# EAGLE design electric-imp-shield-v11 (EAGLE 6.2)
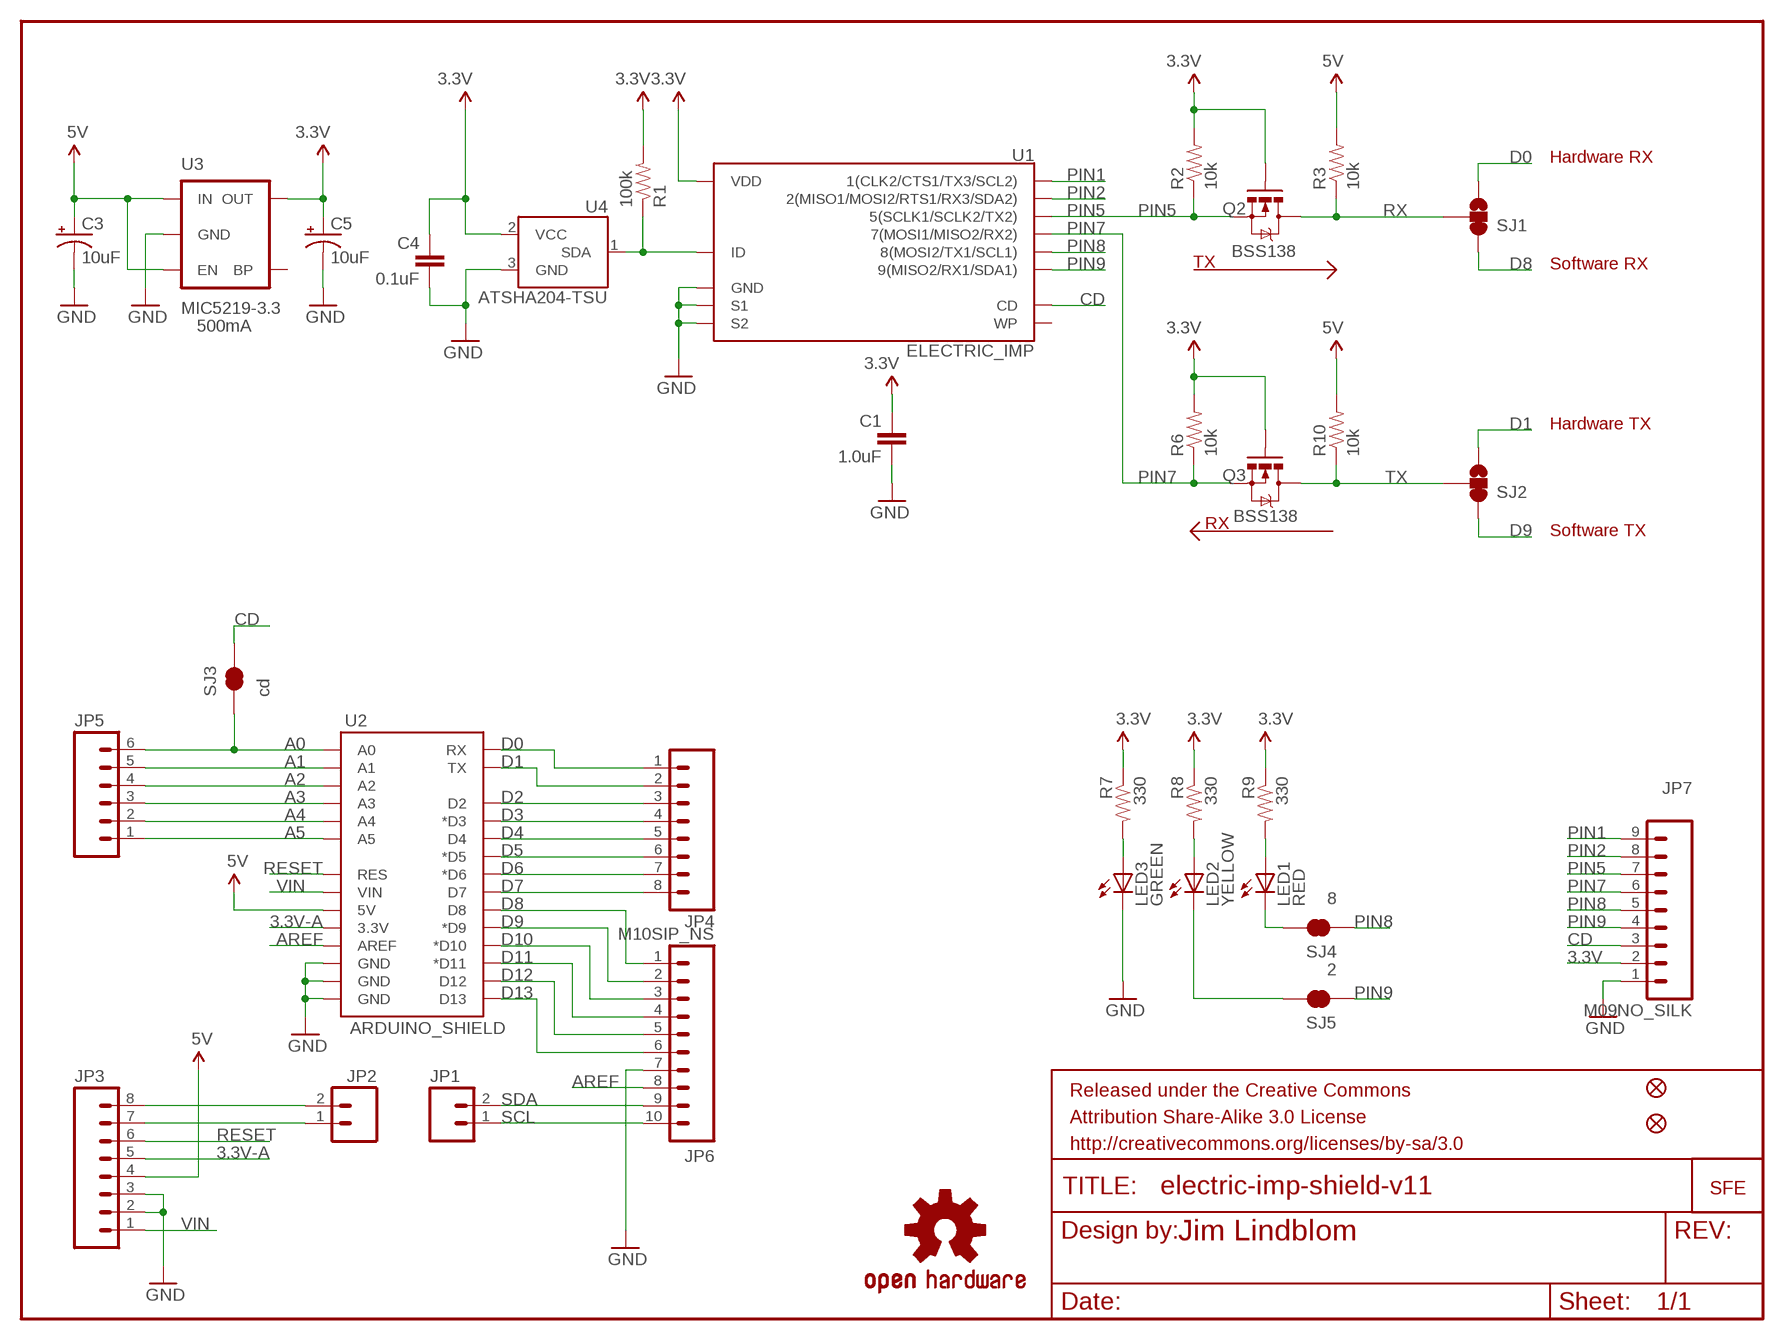
[diagram p0: schematic, sheet 1]

## Parts
C1  1.0uF  CAP0402-CAP  [0402-CAP]
C3  10uF  CAP_POL1206  [EIA3216]
C4  0.1uF  CAP0402-CAP  [0402-CAP]
C5  10uF  CAP_POL1206  [EIA3216]
JP1  M021X02_NO_SILK  [1X02_NO_SILK]
JP2  M021X02_NO_SILK  [1X02_NO_SILK]
JP3  M08SIP_NS  [1X08_NO_SILK]
JP4  M08SIP_NS  [1X08_NO_SILK]
JP5  M06SIP_NS  [1X06_NO_SILK]
JP6  M10SIP_NS  [1X10_NO_SILK]
JP7  M09NO_SILK  [1X09_NO_SILK]
JP8  FIDUCIALUFIDUCIAL  [MICRO-FIDUCIAL]
JP9  FIDUCIALUFIDUCIAL  [MICRO-FIDUCIAL]
JP10  LOGO-SFENW2  [SFE-NEW-WEB]
LED1  RED  LED0603  [LED-0603]
LED2  YELLOW  LED0603  [LED-0603]
LED3  GREEN  LED0603  [LED-0603]
Q2  BSS138  MOSFET-NCHANNELSMD  [SOT23-3]
Q3  BSS138  MOSFET-NCHANNELSMD  [SOT23-3]
R1  100k  RESISTOR0402-RES  [0402-RES]
R2  10k  RESISTOR0402-RES  [0402-RES]
R3  10k  RESISTOR0402-RES  [0402-RES]
R6  10k  RESISTOR0402-RES  [0402-RES]
R7  330  RESISTOR0402-RES  [0402-RES]
R8  330  RESISTOR0402-RES  [0402-RES]
R9  330  RESISTOR0402-RES  [0402-RES]
R10  10k  RESISTOR0402-RES  [0402-RES]
SJ1  SOLDERJUMPER_2WAYS  [SJ_3]
SJ2  SOLDERJUMPER_2WAYS  [SJ_3]
SJ3  cd  SOLDERJUMPERTRACE  [SJ_2S-TRACE]
SJ4  8  SOLDERJUMPERTRACE  [SJ_2S-TRACE]
SJ5  2  SOLDERJUMPERTRACE  [SJ_2S-TRACE]
U1  ELECTRIC_IMP  [SD_MMC_SOCKET]
U2  ARDUINO_SHIELD  ARDUINO_SHIELDNOHOLESORLABELS  [DUEMILANOVE_SHIELD_NOHOLES_NOLABELS]
U3  MIC5219-3.3  V_REG_LDOSMD  [SOT23-5]
U4  ATSHA204-TSU  [SOT23-3]
U$7  OSHW-LOGOS  [OSHW-LOGO-S]

## Nets
3.3V: C1.1 C4.1 C5.A(+) JP7.2 Q2.1(G) Q3.1(G) R1.2 R2.2 R6.2 R7.1 R8.1 R9.1 U1.4(VDD) U3.5(OUT) U4.2(VCC)
3.3V-A: JP3.5 U2.3.3V
5V: C3.A(+) JP3.4 R3.2 R10.2 U2.5V U3.1(IN) U3.3(EN)
A0: JP5.6 SJ3.1 U2.A0
A1: JP5.5 U2.A1
A2: JP5.4 U2.A2
A3: JP5.3 U2.A3
A4: JP5.2 U2.A4
A5: JP5.1 U2.A5
ACTIVITY: LED1.C SJ4.2
AREF: JP6.8 U2.AREF
CD: JP7.3 SJ3.2 U1.CD
D0: JP4.1 SJ1.3 U2.RX
D1: JP4.2 SJ2.3 U2.TX
D2: JP4.3 U2.D2
D3: JP4.4 U2.D3(*D3)
D4: JP4.5 U2.D4
D5: JP4.6 U2.D5(*D5)
D6: JP4.7 U2.D6(*D6)
D7: JP4.8 U2.D7
D8: JP6.1 SJ1.1 U2.D8
D9: JP6.2 SJ2.1 U2.D9(*D9)
D10: JP6.3 U2.D10(*D10)
D11: JP6.4 U2.D11(*D11)
D12: JP6.5 U2.D12
D13: JP6.6 U2.D13
GND: C1.2 C3.C(-) C4.2 C5.C(-) JP3.2 JP3.3 JP6.7 JP7.1 LED3.C U1.3(GND) U1.S1 U1.S2 U2.GND@0(GND) U2.GND@1(GND) U2.GND@2(GND) U3.2(GND) U4.3(GND)
LINK: LED2.C SJ5.2
N$2: R1.1 U1.6(ID) U4.1(SDA)
N$10: JP2.2 JP3.8
N$11: JP2.1 JP3.7
N$12: LED3.A R7.2
N$13: LED2.A R8.2
N$14: LED1.A R9.2
PIN1: JP7.9 U1.1(1(CLK2/CTS1/TX3/SCL2))
PIN2: JP7.8 U1.2(2(MISO1/MOSI2/RTS1/RX3/SDA2))
PIN5: JP7.7 Q2.2(S) R2.1 U1.5(5(SCLK1/SCLK2/TX2))
PIN7: JP7.6 Q3.2(S) R6.1 U1.7(7(MOSI1/MISO2/RX2))
PIN8: JP7.5 SJ4.1 U1.8(8(MOSI2/TX1/SCL1))
PIN9: JP7.4 SJ5.1 U1.9(9(MISO2/RX1/SDA1))
RESET: JP3.6 U2.RES
RX: Q2.3(D) R3.1 SJ1.2
SCL: JP1.1 JP6.10
SDA: JP1.2 JP6.9
TX: Q3.3(D) R10.1 SJ2.2
VIN: JP3.1 U2.VIN
Unconnected: U1.WP U3.4(BP)

## Notes on the sheet
- Hardware RX
- TX | Software RX
- 500mA
- Hardware TX
- RX
- Software TX
- Jim Lindblom

## Library data of the parts
C1 C4 = SparkFun-Passives:CAP: Capacitor Standard 0603 ceramic capacitor, and 0.1" leaded capacitor.
C3 C5 = SparkFun-Passives:CAP_POL: Capacitor Polarized These are standard SMD and PTH capacitors. Normally 10uF, 47uF, and 100uF in electrolytic and tantalum varieties. Always verify the external diameter of the through hole cap, it varies with capacity, voltage, and manufacturer. The EIA devices should be standard.
JP1 JP2 = SparkFun-Connectors:M02: Header 2 Standard 2-pin 0.1" header. Use with straight break away headers (SKU : PRT-00116), right angle break away headers (PRT-00553), swiss pins (PRT-00743), machine pins (PRT-00117), and female headers (PRT-00115). Molex polarized connector foot print use with SKU : PRT-08233 with associated crimp pins and housings.
JP3 JP4 = SparkFun-Connectors:M08: Header 8 Standard 8-pin 0.1" header. Use with straight break away headers (SKU : PRT-00116), right angle break away headers (PRT-00553), swiss pins (PRT-00743), machine pins (PRT-00117), and female headers (PRT-00115).
JP5 = SparkFun-Connectors:M06: Header 6 Standard 6-pin 0.1" header. Use with straight break away headers (SKU : PRT-00116), right angle break away headers (PRT-00553), swiss pins (PRT-00743), machine pins (PRT-00117), and female headers (PRT-00115). Molex polarized connector foot print use with SKU : PRT-08094 with associated crimp pins and housings. NOTES ON THE VARIANTS LOCK and LOCK_LONGPADS... This footprint was designed to help hold the alignment of a through-hole component (i.e. 6-pin header) while soldering it into place. You may notice that each hole has been shifted either up or down by 0.005 of an inch from it's more standard position (which is a perfectly straight line). This slight alteration caused the pins (the squares in the middle) to touch the edges of the holes. Because they are alternating, it causes a "brace" to hold the component in place. 0.005 has proven to be the perfect amount of "off-center" position when using our standard breakaway headers. Although looks a little odd when you look at the bare footprint, once you have a header in there, the alteration is very hard to notice. Also, if you push a header all the way into place, it is covered up entirely on the bottom side. This idea of altering the position of holes to aid alignment will be further integrated into the Sparkfun Library for other footprints. It can help hold any component with 3 or more connection pins.
JP6 = SparkFun-Connectors:M10: Header 10 Standard 10-pin 0.1" header. Use with straight break away headers (SKU : PRT-00116), right angle break away headers (PRT-00553), swiss pins (PRT-00743), machine pins (PRT-00117), and female headers (PRT-00115).
JP7 = SparkFun-Connectors:M09: Header 9 Standard 9-pin 0.1" header. Use with straight break away headers (SKU : PRT-00116), right angle break away headers (PRT-00553), swiss pins (PRT-00743), machine pins (PRT-00117), and female headers (PRT-00115).
JP8 JP9 = SparkFun:FIDUCIAL: Fiducial Alignment Points Various fiducial points for machine vision alignment.
JP10 = SparkFun-Aesthetics:LOGO-SFE: Spark Fun Electronics PCB Logo This is the standard Spark Fun Electronics PCB logo.
LED1-LED3 = SparkFun-LED:LED: LEDs Standard schematic elements and footprints for 5mm, 3mm, 1206, and 0603 sized LEDs. 5mm - Spark Fun Electronics SKU : COM-00529 (and others)
Q2 Q3 = SparkFun-DiscreteSemi:MOSFET-NCHANNEL: Generic NMOS footprint
R1-R3 R6-R10 = SparkFun-Passives:RESISTOR: Resistor Basic schematic elements and footprints for 0603, 1206, and PTH resistors.
SJ1 SJ2 = SparkFun-Passives:SOLDERJUMPER_2WAY: Solder Jumper 2 way solder jumper
SJ3-SJ5 = SparkFun-Passives:SOLDERJUMPER: Solder Jumper Standard SMD solder jumper. Used to automate production. Two varients : Normally Open and Normally Closed are the same, but have different paste layers. NC will have a large amount of paste and should jumper during reflow.
U1 = SparkFun-RF:ELECTRIC_IMP
U2 = SparkFun-Boards:ARDUINO_SHIELD: Arduino shield footprint
U3 = SparkFun-PowerIC:V_REG_LDO: Voltage Regulator LDO Standard 150mA LDO voltage regulator in SOT-23 layout. Micrel part MIC5205. BP (by-pass) pin is used to lower output noise with 470pF cap.
U4 = SparkFun-DigitalIC:ATSHA204
U$7 = SparkFun-Aesthetics:OSHW-LOGO: Open Source Hardware Logo This logo indicates the piece of hardware it is found on incorporates a OSHW license and/or adheres to the definition of open source hardware found here: http://freedomdefined.org/OSHW

## Board
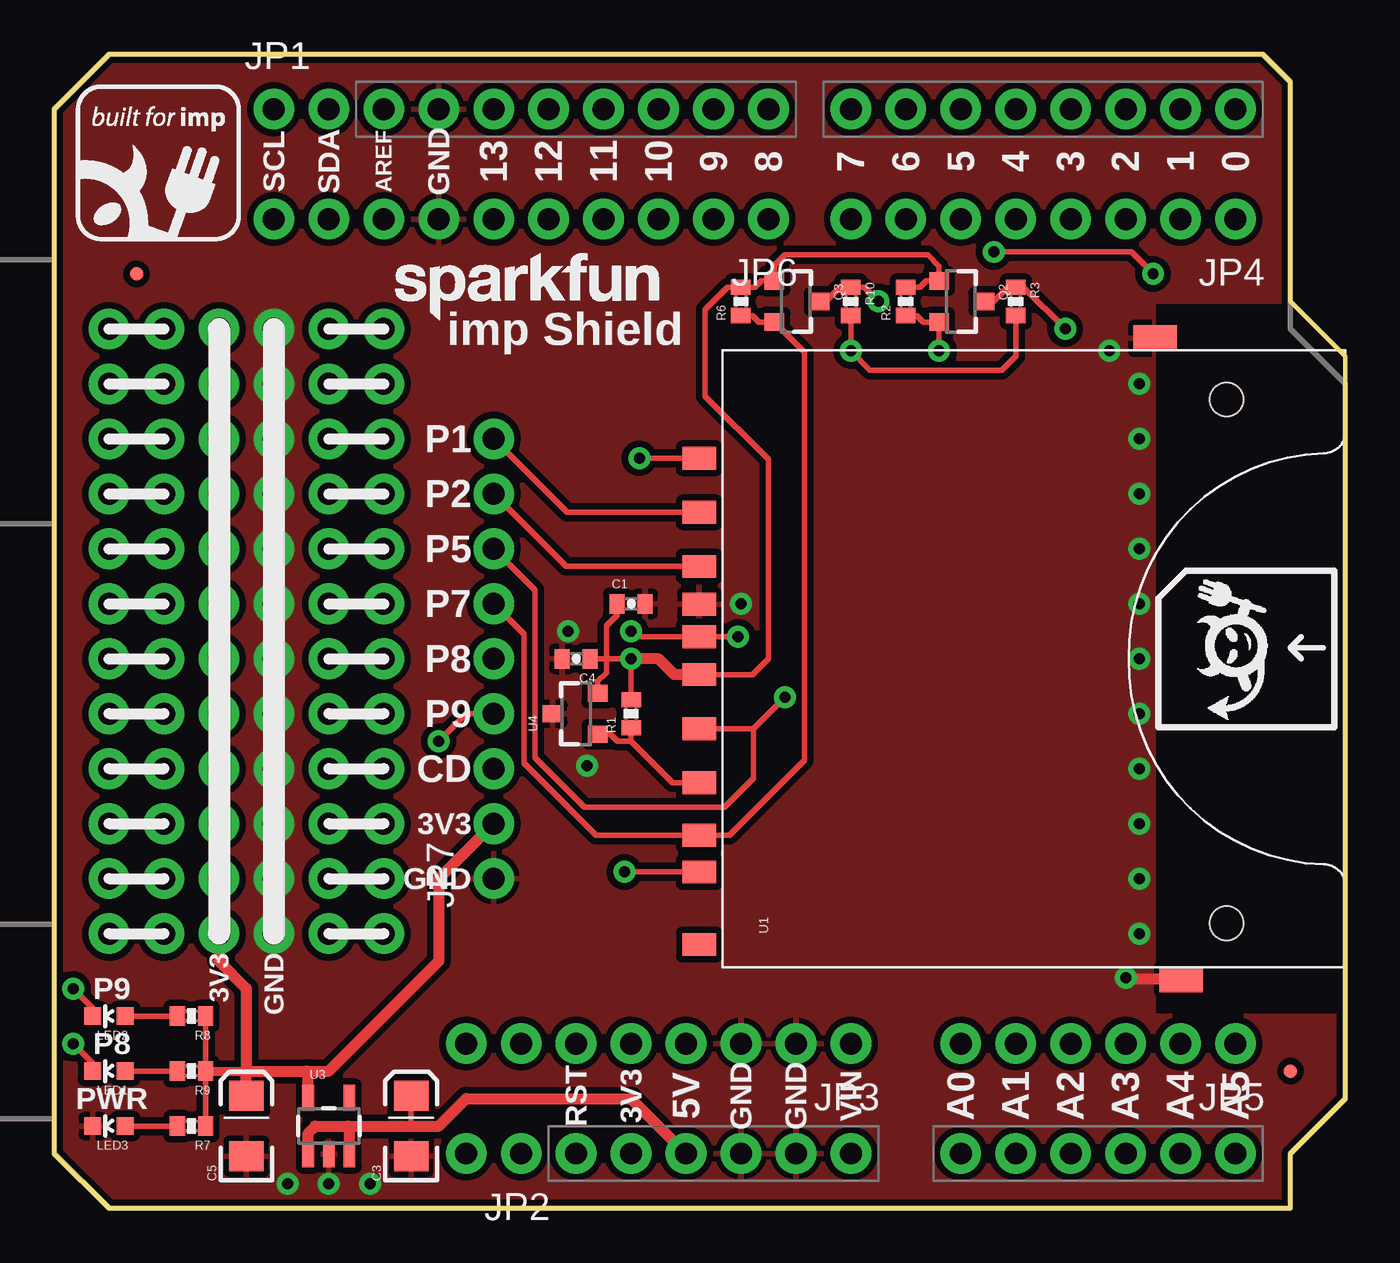
[diagram p1: board, top side]
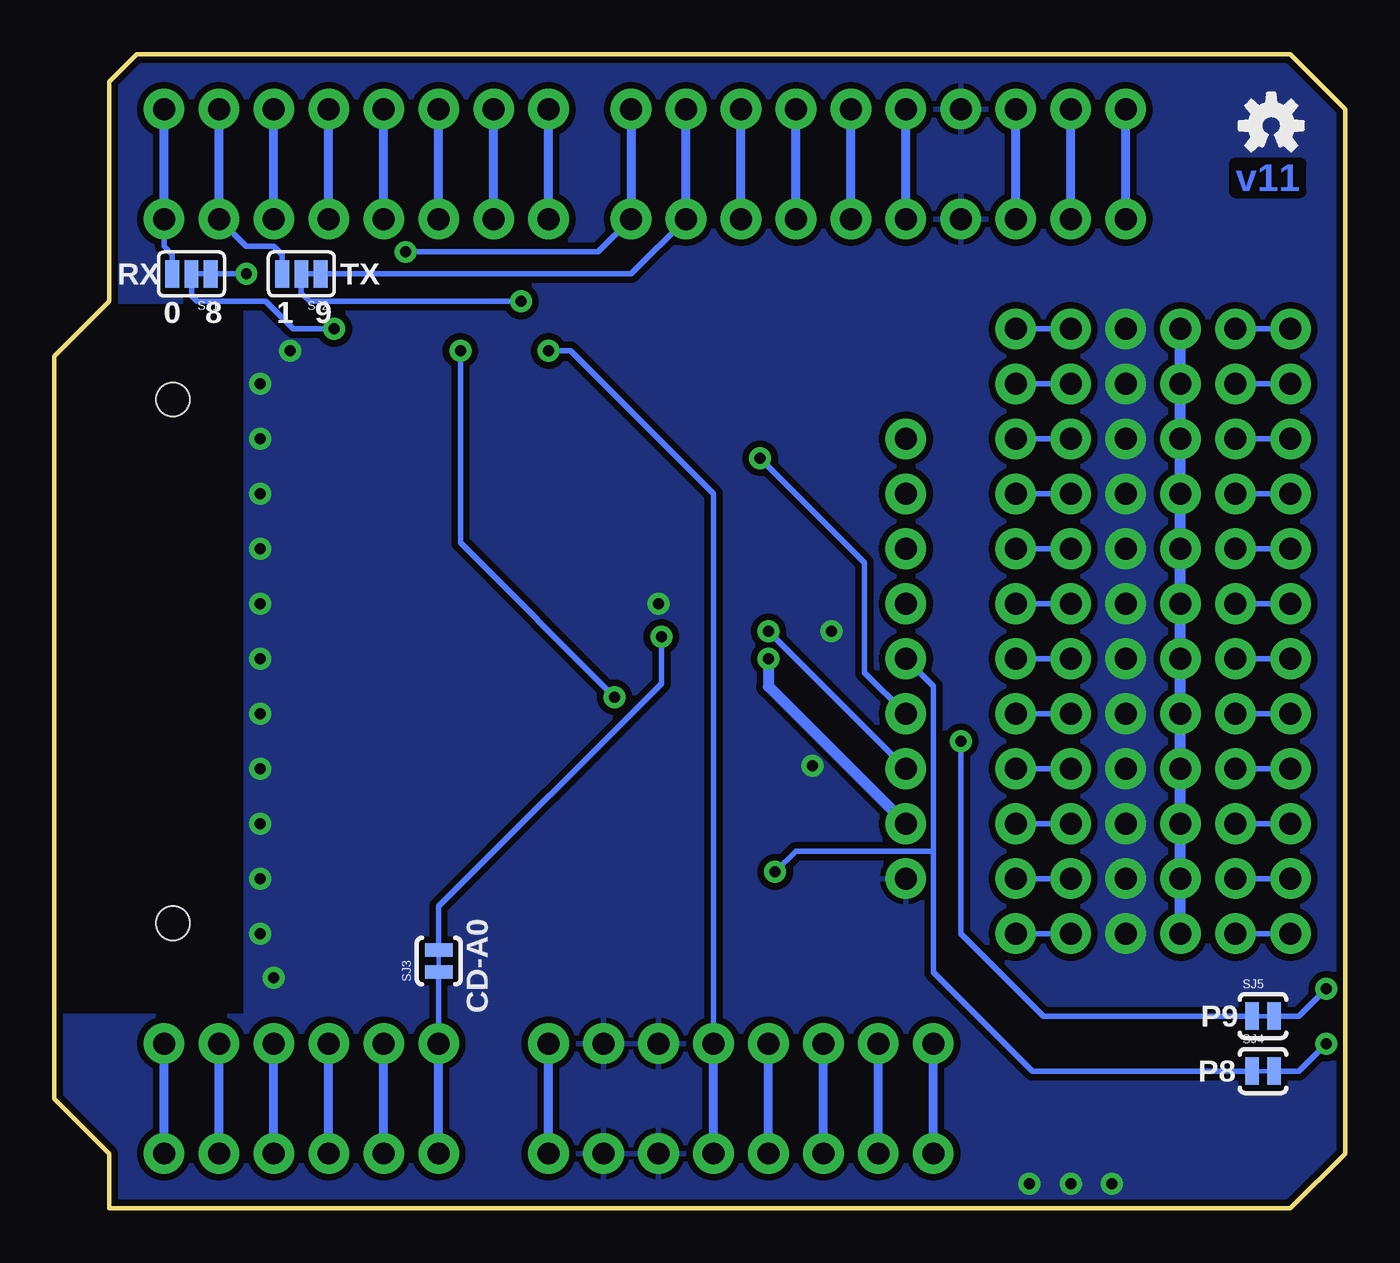
[diagram p2: board, bottom side, seen from below]

Size 59.69 x 53.34 mm. Coordinates in mm from the lower left corner, seen from the top.
Outline: 0,50.8 2.54,53.34 55.88,53.34 57.15,52.07 57.15,41.91 59.69,39.37 59.69,5.08 57.15,2.54 57.15,0 2.54,0 0,2.54 0,50.8
Copper layers (1*16): Top 0.035mm / dielectric 1.5mm / Bottom 0.035mm
Design rules: minimum track width 8mil, minimum drill 20mil, track to track 8mil, track to pad 8mil, pad to pad 8mil, via to via 8mil, smd to smd 8mil, copper to edge 8mil, drill to drill 8mil, minimum pad ring 12mil, minimum via ring 10mil, stop-mask expansion 4mil, vias tented up to drill 20mil, thermal gap 10mil

### Footprints (pad centres in the part's own frame; a part is rotated, then mirrored left to right if it is on the bottom)
0402-CAP = smd 0.7 x 0.9: 1 -0.65,0; 2 0.65,0
EIA3216 = smd 1.4 x 1.6: A 1.4,0; C -1.4,0
1X02_NO_SILK = drill 1.016 pad 1.88: 1 0,0; 2 2.54,0
1X08_NO_SILK = drill 1.016 pad 1.88: 1 0,0; 2 2.54,0; 3 5.08,0; 4 7.62,0; 5 10.16,0; 6 12.7,0; 7 15.24,0; 8 17.78,0
1X06_NO_SILK = drill 1.016 pad 1.88: 1 0,0; 2 2.54,0; 3 5.08,0; 4 7.62,0; 5 10.16,0; 6 12.7,0
1X10_NO_SILK = drill 1.016 pad 1.88: 1 0,0; 2 2.54,0; 3 5.08,0; 4 7.62,0; 5 10.16,0; 6 12.7,0; 7 15.24,0; 8 17.78,0; 9 20.32,0; 10 22.86,0
1X09_NO_SILK = drill 1.016 pad 1.88: 1 0,0; 2 2.54,0; 3 5.08,0; 4 7.62,0; 5 10.16,0; 6 12.7,0; 7 15.24,0; 8 17.78,0; 9 20.32,0
MICRO-FIDUCIAL = smd 0.635 x 0.635: 1 0,0
LED-0603 = smd 0.8 x 0.8: A 0,-0.75; C 0,0.75
SOT23-3 = smd 0.8 x 0.9: 1 -0.95,-1; 2 0.95,-1; 3 0,1.1
0402-RES = smd 0.7 x 0.9: 1 -0.65,0; 2 0.65,0
SJ_3 = smd 0.635 x 1.27: 1 -0.889,0; 2 0,0; 3 0.889,0
SJ_2S-TRACE = smd 0.635 x 1.27: 1 -0.508,0; 2 0.508,0
SD_MMC_SOCKET = smd 1.05 x 1.56: 1 6.77,29.87; 2 4.27,29.87; 3 2.52,29.87; 4 -0.73,29.87; 5 -3.23,29.87; 6 -5.73,29.87; 7 -8.15,29.87; 8 -9.85,29.87; 9 9.27,29.87; CD 1.02,29.87; WP -13.2,29.87 | smd 1.2 x 2: S1 -14.8,7.6; S2 14.8,8.8 | hole 1.55: 11.98,5.5; -12.22,5.5
DUEMILANOVE_SHIELD_NOHOLES_NOLABELS = drill 1.016 pad 1.88: 3.3V 50.8,26.67; 5V 50.8,29.21; A0 50.8,41.91; A1 50.8,44.45; A2 50.8,46.99; A3 50.8,49.53; A4 50.8,52.07; A5 50.8,54.61; AREF 2.54,15.24; D2 2.54,49.53; D3 2.54,46.99; D4 2.54,44.45; D5 2.54,41.91; D6 2.54,39.37; D7 2.54,36.83; D8 2.54,33.02; D9 2.54,30.48; D10 2.54,27.94; D11 2.54,25.4; D12 2.54,22.86; D13 2.54,20.32; GND@0 50.8,31.75; GND@1 50.8,34.29; GND@2 2.54,17.78; RES 50.8,24.13; RX 2.54,54.61; TX 2.54,52.07; VIN 50.8,36.83
SOT23-5 = smd 0.55 x 1.2: 1 -0.95,-1.3; 2 0,-1.3; 3 0.95,-1.3; 4 0.95,1.3; 5 -0.95,1.3

### Placement (x,y rotation side)
C1  26.67,27.94 0 top
C3  16.51,3.81 90 top
C4  24.13,25.4 180 top
C5  8.89,3.81 90 top
JP1  10.16,50.8 0 top
JP2  21.59,2.54 180 top
JP3  36.83,7.62 180 top
JP4  54.61,45.72 180 top
JP5  54.61,7.62 180 top
JP6  33.02,45.72 180 top
JP7  20.32,15.24 90 top
JP8  57.15,6.35 0 top
JP9  3.81,43.18 0 top
JP10  15.75,41.02 0 top
LED1  2.54,6.35 90 top
LED2  2.54,8.89 90 top
LED3  2.54,3.81 90 top
Q2  41.91,41.91 270 top
Q3  34.29,41.91 270 top
R1  26.67,22.86 90 top
R2  39.37,41.91 90 top
R3  44.45,41.91 270 top
R6  31.75,41.91 90 top
R7  6.35,3.81 180 top
R8  6.35,8.89 180 top
R9  6.35,6.35 180 top
R10  36.83,41.91 270 top
SJ1  53.34,43.18 180 bottom
SJ2  48.26,43.18 180 bottom
SJ3  41.91,11.43 90 bottom
SJ4  3.81,6.35 0 bottom
SJ5  3.81,8.89 0 bottom
U1  59.69,25.4 90 top
U2  0,53.34 270 top
U3  12.7,3.81 0 top
U4  24.13,22.86 90 top
U$7  3.43,50.04 0 bottom

### Tracks (layer width: path | path; a pad name or v marks a point on that pad's centre or on a via)
3.3V  (via drill 0.51, 1.02 pad 1.88)
  Top 0.254: R8.1 R9.1 R7.1 | C4.1 25.53,25.4 | 25.53,25.4 v26.67,25.4 R1.2 | U4.2 25.13,24.37 25.53,24.77 25.53,25.4 | U1.4 32.29,24.67 33.02,25.4 33.02,34.61 30.1,37.53 30.1,41.53 31.13,42.56 R6.2 32.4,42.56 32.7,42.86 Q3.1 33.29,43.58 33.78,44.07 40.39,44.07 40.91,43.55 Q2.1 40.32,42.86 40.02,42.56 R2.2 | 25.53,25.4 25.53,26.92 26.02,27.42 C1.1
  Top 0.406: R9.1 8.89,6.35 | 11.75,6.28 11.68,6.35
  Top 0.508: v26.67,25.4 27.94,25.4 28.67,24.67 U1.4 | 8.89,6.35 11.68,6.35 12.7,6.35 17.78,11.43 17.78,15.24 JP7.2 | U3.5 11.75,6.28 | C5.A 8.89,6.35 | v7.62,12.7 7.62,11.43 8.89,10.16 8.89,6.35
  Bottom 0.508: v7.62,12.7 v7.62,15.24 v7.62,17.78 v7.62,20.32 v7.62,22.86 v7.62,25.4 v7.62,27.94 v7.62,30.48 v7.62,33.02 v7.62,35.56 v7.62,38.1 v7.62,40.64 | v26.67,25.4 26.67,24.13 JP7.2
3.3V-A
  Bottom 0.406: U2.3.3V JP3.5
5V  (via drill 0.51)
  Top 0.254: R10.2 v36.83,39.62 37.72,38.73 43.81,38.73 44.45,39.37 R3.2 | C3.A 16.51,3.81
  Top 0.406: 13.65,3.75 13.59,3.81
  Top 0.508: U2.5V 26.67,5.08 19.05,5.08 17.78,3.81 16.51,3.81 13.59,3.81 12.06,3.81 11.75,3.5 U3.1 | U3.3 13.65,3.75
  Bottom 0.254: JP3.4 29.21,33.02 35.81,39.62 v36.83,39.62
  Bottom 0.406: U2.5V JP3.4
A0
  Bottom 0.254: JP5.6 SJ3.1
  Bottom 0.406: U2.A0 JP5.6
A1
  Bottom 0.406: U2.A1 JP5.5
A2
  Bottom 0.406: U2.A2 JP5.4
A3
  Bottom 0.406: U2.A3 JP5.3
A4
  Bottom 0.406: U2.A4 JP5.2
A5
  Bottom 0.406: U2.A5 JP5.1
ACTIVITY  (via drill 0.51)
  Top 0.254: LED1.C 1.79,6.72 v0.89,7.62
  Bottom 0.254: SJ4.2 2.16,6.35 v0.89,7.62
AREF
  Bottom 0.406: JP6.8 U2.AREF
CD  (via drill 0.51)
  Top 0.254: v31.62,26.42 U1.CD 26.92,26.42 v26.67,26.67
  Bottom 0.254: SJ3.2 41.91,13.97 31.62,24.26 v31.62,26.42 | JP7.3 v26.67,26.67
D0
  Bottom 0.254: SJ1.3 54.23,44.07 54.61,44.45 JP4.1
  Bottom 0.406: JP4.1 U2.RX
D1
  Bottom 0.254: SJ2.3 49.15,44.07 49.53,44.45 50.8,44.45 JP4.2
  Bottom 0.406: JP4.2 U2.TX
D2
  Bottom 0.406: JP4.3 U2.D2
D3
  Bottom 0.406: JP4.4 U2.D3
D4
  Bottom 0.406: JP4.5 U2.D4
D5
  Bottom 0.406: JP4.6 U2.D5
D6
  Bottom 0.406: JP4.7 U2.D6
D7
  Bottom 0.406: JP4.8 U2.D7
D8  (via drill 0.51)
  Top 0.254: v43.43,44.2 49.78,44.2 v50.8,43.18
  Bottom 0.254: v43.43,44.2 34.54,44.2 JP6.1 | SJ1.1 v50.8,43.18
  Bottom 0.406: U2.D8 JP6.1
D9
  Bottom 0.254: SJ2.1 33.02,43.18 JP6.2
  Bottom 0.406: JP6.2 U2.D9
D10
  Bottom 0.406: JP6.3 U2.D10
D11
  Bottom 0.406: JP6.4 U2.D11
D12
  Bottom 0.406: JP6.5 U2.D12
D13
  Bottom 0.406: JP6.6 U2.D13
GND  (via drill 0.51, 1.02 pad 1.88)
  Top 0.508: U1.S1 49.6,10.6 v49.53,10.67
  other vias: 31.75,27.94 48.77,39.62 10.16,40.64 10.16,38.1 10.16,35.56 10.16,33.02 10.16,30.48 10.16,27.94 10.16,25.4 10.16,22.86 10.16,20.32 10.16,17.78 10.16,15.24 10.16,12.7 23.75,26.67 24.64,20.45 50.16,12.7 50.16,15.24 50.16,17.78 50.16,20.32 50.16,22.86 50.16,25.4 50.16,27.94 50.16,30.48 50.16,33.02 50.16,35.56 50.16,38.1 10.79,1.14 14.61,1.14 12.7,1.14
  pour Top (isolate 0.305): 0,53.34 0,0 59.69,0 59.69,8.89 50.8,8.89 50.8,41.91 59.69,41.91 59.69,53.34
  pour Bottom (isolate 0.305): 0,53.34 0,0 59.69,0 59.69,8.89 50.8,8.89 50.8,41.91 59.69,41.91 59.69,53.34
LINK  (via drill 0.51)
  Top 0.254: LED2.C 1.79,9.26 v0.89,10.16
  Bottom 0.254: SJ5.2 2.16,8.89 v0.89,10.16
N$2
  Top 0.254: U1.6 28.59,19.67 26.67,21.59 | 26.67,21.59 R1.1 | U4.1 25.71,21.91 26.04,21.59 26.67,21.59
N$10
  Bottom 0.406: JP2.2 JP3.8
N$11
  Bottom 0.406: JP2.1 JP3.7
N$12
  Top 0.254: R7.2 LED3.A
N$13
  Top 0.254: R8.2 LED2.A
N$14
  Top 0.254: R9.2 LED1.A
N$15  (via drill 1.02 pad 1.88)
  Bottom 0.254: v12.7,15.24 v15.24,15.24
N$17  (via drill 1.02 pad 1.88)
  Bottom 0.254: v12.7,12.7 v15.24,12.7
N$22  (via drill 1.02 pad 1.88)
  Bottom 0.254: v5.08,12.7 v2.54,12.7
N$24  (via drill 1.02 pad 1.88)
  Bottom 0.254: v12.7,17.78 v15.24,17.78
N$29  (via drill 1.02 pad 1.88)
  Bottom 0.254: v5.08,17.78 v2.54,17.78
N$31  (via drill 1.02 pad 1.88)
  Bottom 0.254: v5.08,40.64 v2.54,40.64
N$36  (via drill 1.02 pad 1.88)
  Bottom 0.254: v12.7,40.64 v15.24,40.64
N$40  (via drill 1.02 pad 1.88)
  Bottom 0.254: v12.7,20.32 v15.24,20.32
N$45  (via drill 1.02 pad 1.88)
  Bottom 0.254: v5.08,20.32 v2.54,20.32
N$48  (via drill 1.02 pad 1.88)
  Bottom 0.254: v12.7,22.86 v15.24,22.86
N$49  (via drill 1.02 pad 1.88)
  Bottom 0.254: v5.08,15.24 v2.54,15.24
N$55  (via drill 1.02 pad 1.88)
  Bottom 0.254: v5.08,22.86 v2.54,22.86
N$56  (via drill 1.02 pad 1.88)
  Bottom 0.254: v12.7,25.4 v15.24,25.4
N$61  (via drill 1.02 pad 1.88)
  Bottom 0.254: v5.08,25.4 v2.54,25.4
N$64  (via drill 1.02 pad 1.88)
  Bottom 0.254: v15.24,27.94 v12.7,27.94
N$69  (via drill 1.02 pad 1.88)
  Bottom 0.254: v5.08,27.94 v2.54,27.94
N$70  (via drill 1.02 pad 1.88)
  Bottom 0.254: v12.7,30.48 v15.24,30.48
N$75  (via drill 1.02 pad 1.88)
  Bottom 0.254: v5.08,30.48 v2.54,30.48
N$78  (via drill 1.02 pad 1.88)
  Bottom 0.254: v12.7,33.02 v15.24,33.02
N$83  (via drill 1.02 pad 1.88)
  Bottom 0.254: v5.08,33.02 v2.54,33.02
N$84  (via drill 1.02 pad 1.88)
  Bottom 0.254: v12.7,35.56 v15.24,35.56
N$89  (via drill 1.02 pad 1.88)
  Bottom 0.254: v5.08,35.56 v2.54,35.56
N$92  (via drill 1.02 pad 1.88)
  Bottom 0.254: v5.08,38.1 v2.54,38.1
N$97  (via drill 1.02 pad 1.88)
  Bottom 0.254: v12.7,38.1 v15.24,38.1
N$99
  Bottom 0.254: 48.26,43.18 47.37,43.18
N$100
  Bottom 0.254: 53.34,43.18 52.45,43.18
PIN1
  Top 0.254: U1.1 23.71,32.17 JP7.9
PIN2
  Top 0.254: U1.2 23.67,29.67 JP7.8
PIN5  (via drill 0.51)
  Top 0.254: U1.5 32.33,22.17 | R2.1 39.89,41.26 40.19,40.96 Q2.2 v40.91,39.64 | 32.33,22.17 32.33,19.88 30.99,18.54 24.51,18.54 22.23,20.83 22.23,28.57 JP7.7 | v33.78,23.62 32.33,22.17
  Bottom 0.254: v33.78,23.62 40.91,30.75 v40.91,39.64
PIN7
  Top 0.254: R6.1 32.27,41.26 32.57,40.96 Q3.2 34.69,39.56 34.69,20.72 31.22,17.25 U1.7 25.04,17.25 21.72,20.57 21.72,26.54 JP7.6
PIN8  (via drill 0.51)
  Top 0.254: v26.36,15.55 U1.8
  Bottom 0.254: SJ4.1 14.48,6.35 19.05,10.92 19.05,16.51 | 19.05,16.51 19.05,24.13 JP7.5 | v26.36,15.55 25.4,16.51 19.05,16.51
PIN9  (via drill 0.51)
  Top 0.254: U1.9 v27.05,34.67 | JP7.4 19.05,22.86 v17.78,21.59
  Bottom 0.254: JP7.4 22.23,24.77 22.23,29.84 v27.05,34.67 | v17.78,21.59 17.78,12.7 13.97,8.89 SJ5.1
RESET
  Bottom 0.406: U2.RES JP3.6
RX  (via drill 0.51)
  Top 0.254: Q2.3 43.43,41.91 44.08,42.56 R3.1 44.82,42.56 v46.74,40.64
  Bottom 0.254: SJ1.2 53.34,42.16 53.09,41.91 49.91,41.91 48.64,40.64 v46.74,40.64
SCL
  Bottom 0.406: JP6.10 JP1.1
SDA
  Bottom 0.406: JP6.9 JP1.2
TX  (via drill 0.51)
  Top 0.254: Q3.3 35.69,41.91 36.34,42.56 R10.1 37.45,42.56 v38.1,41.91
  Bottom 0.254: SJ2.2 48.26,42.29 47.88,41.91 v38.1,41.91
VIN
  Bottom 0.406: U2.VIN JP3.1

### Text on the board
Bottom: v11
tPlace: SCL | SDA | AREF | GND | 13 | 12 | 11 | 10 | 9 | 8 | 7 | 6 | 5 | 4 | 3 | 2 | 1 | 0 | imp Shield | P1 | P2 | P5 | P7 | P8 | P9 | CD | 3V3 | GND | 3V3 | GND | P9 | P8 | PWR | RST | 3V3 | 5V | GND | GND | VIN | A0 | A1 | A2 | A3 | A4 | A5
bPlace: TX | RX | 9 | 1 | 8 | 0 | P9 | CD-A0 | P8